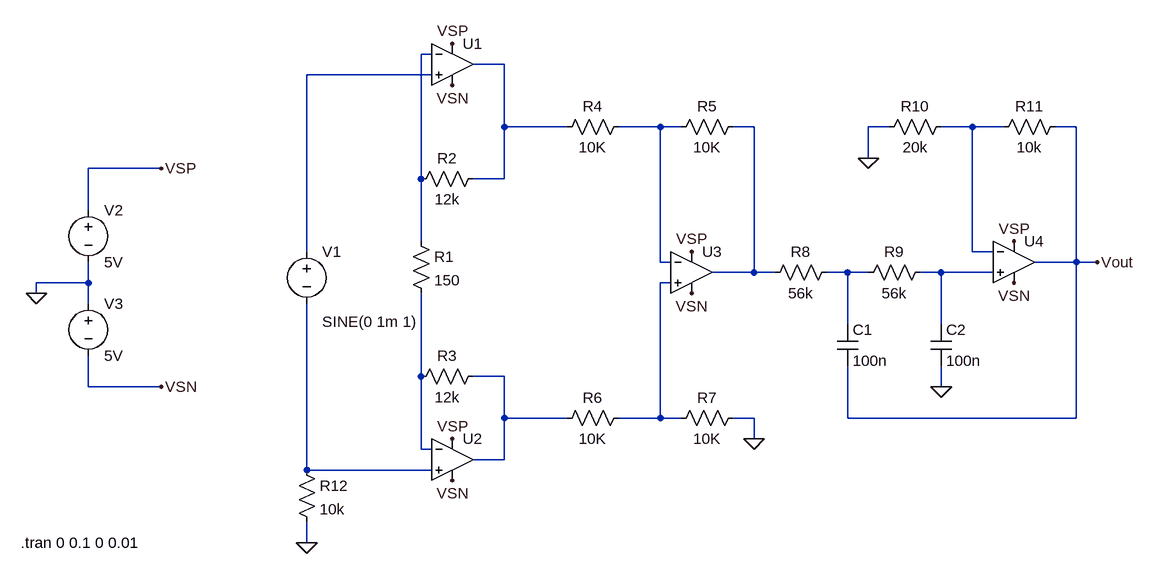
[diagram p0: schematic Draft1.asc]
Draft1.asc, the LTspice schematic file:
Version 4
SHEET 1 1640 680
WIRE 544 -208 528 -208
WIRE 656 -192 608 -192
WIRE 544 -176 352 -176
WIRE 656 -96 656 -192
WIRE 752 -96 656 -96
WIRE 896 -96 832 -96
WIRE 928 -96 896 -96
WIRE 1040 -96 1008 -96
WIRE 1248 -96 1216 -96
WIRE 1376 -96 1328 -96
WIRE 1424 -96 1376 -96
WIRE 1536 -96 1504 -96
WIRE 1216 -48 1216 -96
WIRE 128 -32 16 -32
WIRE 528 -16 528 -208
WIRE 656 -16 656 -96
WIRE 656 -16 608 -16
WIRE 16 32 16 -32
WIRE 528 80 528 -16
WIRE 352 96 352 -176
WIRE 1376 96 1376 -96
WIRE 1408 96 1376 96
WIRE 896 112 896 -96
WIRE 912 112 896 112
WIRE 1536 112 1536 -96
WIRE 1536 112 1472 112
WIRE 1568 112 1536 112
WIRE 1040 128 1040 -96
WIRE 1040 128 976 128
WIRE 1072 128 1040 128
WIRE 1184 128 1152 128
WIRE 1216 128 1184 128
WIRE 1328 128 1296 128
WIRE 1408 128 1328 128
WIRE 16 144 16 112
WIRE 16 144 -64 144
WIRE 912 144 896 144
WIRE -64 160 -64 144
WIRE 16 176 16 144
WIRE 1184 208 1184 128
WIRE 1328 208 1328 128
WIRE 528 288 528 160
WIRE 656 288 608 288
WIRE 16 304 16 256
WIRE 128 304 16 304
WIRE 1328 304 1328 272
WIRE 656 352 656 288
WIRE 752 352 656 352
WIRE 896 352 896 144
WIRE 896 352 832 352
WIRE 928 352 896 352
WIRE 1040 352 1008 352
WIRE 1184 352 1184 272
WIRE 1536 352 1536 112
WIRE 1536 352 1184 352
WIRE 1040 384 1040 352
WIRE 528 400 528 288
WIRE 544 400 528 400
WIRE 656 416 656 352
WIRE 656 416 608 416
WIRE 352 432 352 176
WIRE 544 432 352 432
WIRE 352 544 352 512
FLAG -64 160 0
FLAG 128 304 VSN
FLAG 128 -32 VSP
FLAG 576 -224 VSP
FLAG 576 384 VSP
FLAG 576 448 VSN
FLAG 576 -160 VSN
FLAG 944 160 VSN
FLAG 944 96 VSP
FLAG 1040 384 0
FLAG 1328 304 0
FLAG 1568 112 Vout
FLAG 1440 80 VSP
FLAG 1440 144 VSN
FLAG 1216 -48 0
FLAG 352 544 0
SYMBOL voltage 16 160 R0
SYMATTR InstName V3
SYMATTR Value 5V
SYMBOL voltage 16 16 R0
SYMATTR InstName V2
SYMATTR Value 5V
SYMBOL voltage 352 80 R0
WINDOW 123 0 0 Left 0
WINDOW 39 24 124 Left 2
SYMATTR SpiceLine SINE(0 1m 1)
SYMATTR InstName V1
SYMATTR Value ""
SYMBOL OpAmps\\UniversalOpamp 576 -192 R0
SYMATTR InstName U1
SYMBOL OpAmps\\UniversalOpamp 576 416 R0
SYMATTR InstName U2
SYMBOL res 512 64 R0
SYMATTR InstName R1
SYMATTR Value 150
SYMBOL res 624 -32 R90
WINDOW 0 0 56 VBottom 2
WINDOW 3 32 56 VTop 2
SYMATTR InstName R2
SYMATTR Value 12k
SYMBOL res 624 272 R90
WINDOW 0 0 56 VBottom 2
WINDOW 3 32 56 VTop 2
SYMATTR InstName R3
SYMATTR Value 12k
SYMBOL res 848 -112 R90
WINDOW 0 0 56 VBottom 2
WINDOW 3 32 56 VTop 2
SYMATTR InstName R4
SYMATTR Value 10K
SYMBOL res 848 336 R90
WINDOW 0 0 56 VBottom 2
WINDOW 3 32 56 VTop 2
SYMATTR InstName R6
SYMATTR Value 10K
SYMBOL OpAmps\\UniversalOpamp 944 128 R0
SYMATTR InstName U3
SYMBOL res 1024 -112 R90
WINDOW 0 0 56 VBottom 2
WINDOW 3 32 56 VTop 2
SYMATTR InstName R5
SYMATTR Value 10K
SYMBOL res 1024 336 R90
WINDOW 0 0 56 VBottom 2
WINDOW 3 32 56 VTop 2
SYMATTR InstName R7
SYMATTR Value 10K
SYMBOL res 1168 112 R90
WINDOW 0 0 56 VBottom 2
WINDOW 3 32 56 VTop 2
SYMATTR InstName R8
SYMATTR Value 56k
SYMBOL res 1312 112 R90
WINDOW 0 0 56 VBottom 2
WINDOW 3 32 56 VTop 2
SYMATTR InstName R9
SYMATTR Value 56k
SYMBOL res 1344 -112 R90
WINDOW 0 0 56 VBottom 2
WINDOW 3 32 56 VTop 2
SYMATTR InstName R10
SYMATTR Value 20k
SYMBOL res 1520 -112 R90
WINDOW 0 0 56 VBottom 2
WINDOW 3 32 56 VTop 2
SYMATTR InstName R11
SYMATTR Value 10k
SYMBOL OpAmps\\UniversalOpamp 1440 112 R0
SYMATTR InstName U4
SYMBOL cap 1168 208 R0
SYMATTR InstName C1
SYMATTR Value 100n
SYMBOL cap 1312 208 R0
SYMATTR InstName C2
SYMATTR Value 100n
SYMBOL res 336 416 R0
SYMATTR InstName R12
SYMATTR Value 10k
TEXT -88 544 Left 2 !.tran 0 0.1 0 0.01

The netlist it stands for:
* Draft1.asc
V3 0 VSN 5V
V2 VSP 0 5V
V1 N003 N012 SINE(0 1m 1)
XU1 N003 N001 VSP VSN N002 level1 Avol=1Meg GBW=10Meg Vos=0 En=0 Enk=0 In=0 Ink=0 Rin=500Meg  ; pins In+ In- V+ V- OUT
XU2 N012 N010 VSP VSN N011 level1 Avol=1Meg GBW=10Meg Vos=0 En=0 Enk=0 In=0 Ink=0 Rin=500Meg  ; pins In+ In- V+ V- OUT
R1 N001 N010 150
R2 N002 N001 12k
R3 N011 N010 12k
R4 N004 N002 10K
R6 N009 N011 10K
XU3 N009 N004 VSP VSN N005 level1 Avol=1Meg GBW=10Meg Vos=0 En=0 Enk=0 In=0 Ink=0 Rin=500Meg  ; pins In+ In- V+ V- OUT
R5 N005 N004 10K
R7 0 N009 10K
R8 N007 N005 56k
R9 N008 N007 56k
R10 N006 0 20k
R11 Vout N006 10k
XU4 N008 N006 VSP VSN Vout level1 Avol=1Meg GBW=10Meg Vos=0 En=0 Enk=0 In=0 Ink=0 Rin=500Meg  ; pins In+ In- V+ V- OUT
C1 N007 Vout 100n
C2 N008 0 100n
R12 N012 0 10k
.tran 0 0.1 0 0.01
.lib UniversalOpAmp1.lib
.backanno
.end